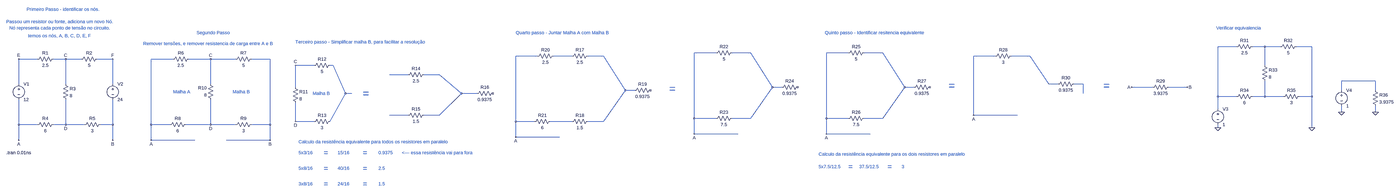
[diagram p0: schematic Mesh.asc, whole sheet]
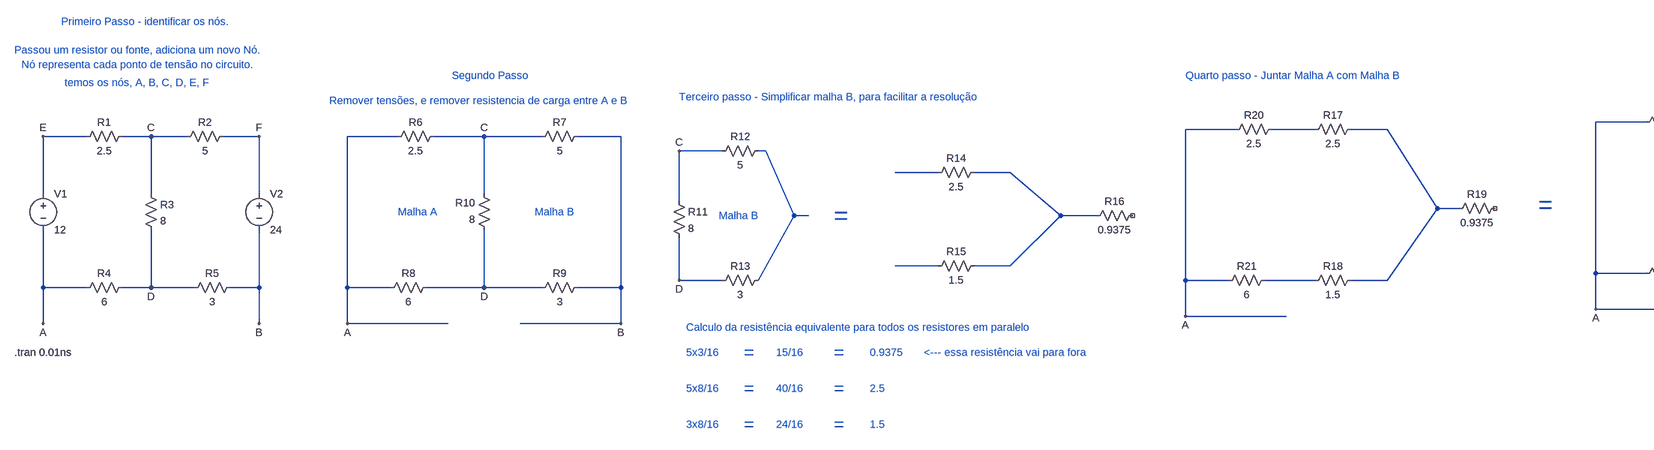
[diagram p1: schematic Mesh.asc, part, row 1 of 1, column 1 of 2]
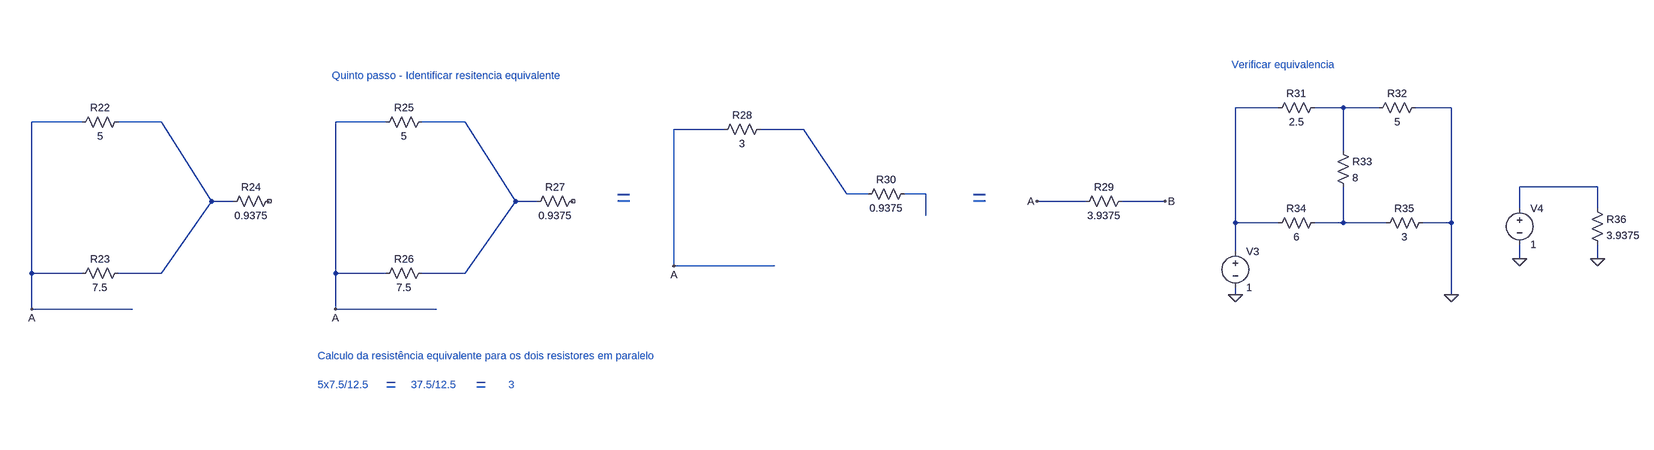
[diagram p2: schematic Mesh.asc, part, row 1 of 1, column 2 of 2]
Mesh.asc, the LTspice schematic file:
Version 4
SHEET 1 7752 680
WIRE 6704 -896 6608 -896
WIRE 6848 -896 6784 -896
WIRE 6928 -896 6848 -896
WIRE 7088 -896 7008 -896
WIRE 3168 -864 3056 -864
WIRE 3344 -864 3248 -864
WIRE 4160 -864 4048 -864
WIRE 4336 -864 4240 -864
WIRE 2256 -848 2144 -848
WIRE 2432 -848 2336 -848
WIRE 2592 -848 2512 -848
WIRE 4912 -848 4800 -848
WIRE 5088 -848 4992 -848
WIRE -576 -832 -672 -832
WIRE -432 -832 -496 -832
WIRE -352 -832 -432 -832
WIRE -192 -832 -272 -832
WIRE 128 -832 16 -832
WIRE 320 -832 208 -832
WIRE 448 -832 320 -832
WIRE 624 -832 528 -832
WIRE 976 -800 880 -800
WIRE 1072 -800 1056 -800
WIRE 6848 -800 6848 -896
WIRE 1456 -752 1360 -752
WIRE 1616 -752 1536 -752
WIRE 7648 -720 7440 -720
WIRE -672 -704 -672 -832
WIRE -432 -704 -432 -832
WIRE -192 -704 -192 -832
WIRE 320 -704 320 -832
WIRE 5184 -704 5088 -848
WIRE 5232 -704 5184 -704
WIRE 5360 -704 5312 -704
WIRE 880 -688 880 -800
WIRE 3456 -688 3344 -864
WIRE 3504 -688 3456 -688
WIRE 4448 -688 4336 -864
WIRE 4496 -688 4448 -688
WIRE 5776 -688 5664 -688
WIRE 5952 -688 5856 -688
WIRE 2704 -672 2592 -848
WIRE 2752 -672 2704 -672
WIRE 7440 -672 7440 -720
WIRE 7648 -672 7648 -720
WIRE 1136 -656 1072 -800
WIRE 1168 -656 1136 -656
WIRE 1728 -656 1616 -752
WIRE 1808 -656 1728 -656
WIRE 5360 -656 5360 -704
WIRE 6608 -640 6608 -896
WIRE 6704 -640 6608 -640
WIRE 6848 -640 6848 -720
WIRE 6848 -640 6784 -640
WIRE 6944 -640 6848 -640
WIRE 7088 -640 7088 -896
WIRE 7088 -640 7024 -640
WIRE 6608 -576 6608 -640
WIRE 7440 -560 7440 -592
WIRE 7648 -560 7648 -592
WIRE 1456 -544 1360 -544
WIRE 1616 -544 1728 -656
WIRE 1616 -544 1536 -544
WIRE 4800 -544 4800 -848
WIRE 5024 -544 4800 -544
WIRE 3056 -528 3056 -864
WIRE 3168 -528 3056 -528
WIRE 3344 -528 3456 -688
WIRE 3344 -528 3248 -528
WIRE 4048 -528 4048 -864
WIRE 4160 -528 4048 -528
WIRE 4336 -528 4448 -688
WIRE 4336 -528 4240 -528
WIRE 880 -512 880 -608
WIRE 976 -512 880 -512
WIRE 1056 -512 1136 -656
WIRE 2144 -512 2144 -848
WIRE 2240 -512 2144 -512
WIRE 2432 -512 2320 -512
WIRE 2592 -512 2704 -672
WIRE 2592 -512 2512 -512
WIRE -672 -496 -672 -624
WIRE -576 -496 -672 -496
WIRE -432 -496 -432 -624
WIRE -432 -496 -496 -496
WIRE -336 -496 -432 -496
WIRE -192 -496 -192 -624
WIRE -192 -496 -256 -496
WIRE 16 -496 16 -832
WIRE 112 -496 16 -496
WIRE 320 -496 320 -624
WIRE 320 -496 192 -496
WIRE 448 -496 320 -496
WIRE 624 -496 624 -832
WIRE 624 -496 528 -496
WIRE 6608 -480 6608 -496
WIRE 7088 -480 7088 -640
WIRE 3056 -448 3056 -528
WIRE 3280 -448 3056 -448
WIRE 4048 -448 4048 -528
WIRE 4272 -448 4048 -448
WIRE 2144 -432 2144 -512
WIRE 2368 -432 2144 -432
WIRE -672 -416 -672 -496
WIRE -192 -416 -192 -496
WIRE 16 -416 16 -496
WIRE 240 -416 16 -416
WIRE 624 -416 624 -496
WIRE 624 -416 400 -416
FLAG -672 -832 E
FLAG -432 -832 C
FLAG -192 -832 F
FLAG -672 -416 A
FLAG -192 -416 B
FLAG -432 -496 D
FLAG 16 -416 A
FLAG 624 -416 B
FLAG 2144 -432 A
FLAG 3056 -448 A
FLAG 4048 -448 A
FLAG 4800 -544 A
FLAG 320 -832 C
FLAG 320 -496 D
FLAG 5664 -688 A
FLAG 5952 -688 B
FLAG 7088 -480 0
FLAG 7648 -560 0
FLAG 7440 -560 0
FLAG 6608 -480 0
FLAG 880 -800 C
FLAG 880 -512 D
SYMBOL voltage -672 -720 R0
WINDOW 123 0 0 Left 0
WINDOW 39 0 0 Left 0
SYMATTR InstName V1
SYMATTR Value 12
SYMBOL voltage -192 -720 R0
WINDOW 123 0 0 Left 0
WINDOW 39 0 0 Left 0
SYMATTR InstName V2
SYMATTR Value 24
SYMBOL res -480 -848 R90
WINDOW 0 0 56 VBottom 2
WINDOW 3 32 56 VTop 2
SYMATTR InstName R1
SYMATTR Value 2.5
SYMBOL res -256 -848 R90
WINDOW 0 0 56 VBottom 2
WINDOW 3 32 56 VTop 2
SYMATTR InstName R2
SYMATTR Value 5
SYMBOL res -448 -720 R0
SYMATTR InstName R3
SYMATTR Value 8
SYMBOL res -480 -512 R90
WINDOW 0 0 56 VBottom 2
WINDOW 3 32 56 VTop 2
SYMATTR InstName R4
SYMATTR Value 6
SYMBOL res -240 -512 R90
WINDOW 0 0 56 VBottom 2
WINDOW 3 32 56 VTop 2
SYMATTR InstName R5
SYMATTR Value 3
SYMBOL res 224 -848 R90
WINDOW 0 0 56 VBottom 2
WINDOW 3 32 56 VTop 2
SYMATTR InstName R6
SYMATTR Value 2.5
SYMBOL res 544 -848 R90
WINDOW 0 0 56 VBottom 2
WINDOW 3 32 56 VTop 2
SYMATTR InstName R7
SYMATTR Value 5
SYMBOL res 208 -512 R90
WINDOW 0 0 56 VBottom 2
WINDOW 3 32 56 VTop 2
SYMATTR InstName R8
SYMATTR Value 6
SYMBOL res 544 -512 R90
WINDOW 0 0 56 VBottom 2
WINDOW 3 32 56 VTop 2
SYMATTR InstName R9
SYMATTR Value 3
SYMBOL res 336 -608 R180
WINDOW 0 36 76 Left 2
WINDOW 3 36 40 Left 2
SYMATTR InstName R10
SYMATTR Value 8
SYMBOL res 864 -704 R0
SYMATTR InstName R11
SYMATTR Value 8
SYMBOL res 1072 -816 R90
WINDOW 0 0 56 VBottom 2
WINDOW 3 32 56 VTop 2
SYMATTR InstName R12
SYMATTR Value 5
SYMBOL res 1072 -528 R90
WINDOW 0 0 56 VBottom 2
WINDOW 3 32 56 VTop 2
SYMATTR InstName R13
SYMATTR Value 3
SYMBOL res 1552 -768 R90
WINDOW 0 0 56 VBottom 2
WINDOW 3 32 56 VTop 2
SYMATTR InstName R14
SYMATTR Value 2.5
SYMBOL res 1552 -560 R90
WINDOW 0 0 56 VBottom 2
WINDOW 3 32 56 VTop 2
SYMATTR InstName R15
SYMATTR Value 1.5
SYMBOL res 1904 -672 R90
WINDOW 0 0 56 VBottom 2
WINDOW 3 32 56 VTop 2
SYMATTR InstName R16
SYMATTR Value 0.9375
SYMBOL res 2528 -864 R90
WINDOW 0 0 56 VBottom 2
WINDOW 3 32 56 VTop 2
SYMATTR InstName R17
SYMATTR Value 2.5
SYMBOL res 2528 -528 R90
WINDOW 0 0 56 VBottom 2
WINDOW 3 32 56 VTop 2
SYMATTR InstName R18
SYMATTR Value 1.5
SYMBOL res 2848 -688 R90
WINDOW 0 0 56 VBottom 2
WINDOW 3 32 56 VTop 2
SYMATTR InstName R19
SYMATTR Value 0.9375
SYMBOL res 2352 -864 R90
WINDOW 0 0 56 VBottom 2
WINDOW 3 32 56 VTop 2
SYMATTR InstName R20
SYMATTR Value 2.5
SYMBOL res 2336 -528 R90
WINDOW 0 0 56 VBottom 2
WINDOW 3 32 56 VTop 2
SYMATTR InstName R21
SYMATTR Value 6
SYMBOL res 3264 -880 R90
WINDOW 0 0 56 VBottom 2
WINDOW 3 32 56 VTop 2
SYMATTR InstName R22
SYMATTR Value 5
SYMBOL res 3264 -544 R90
WINDOW 0 0 56 VBottom 2
WINDOW 3 32 56 VTop 2
SYMATTR InstName R23
SYMATTR Value 7.5
SYMBOL res 3600 -704 R90
WINDOW 0 0 56 VBottom 2
WINDOW 3 32 56 VTop 2
SYMATTR InstName R24
SYMATTR Value 0.9375
SYMBOL res 4256 -880 R90
WINDOW 0 0 56 VBottom 2
WINDOW 3 32 56 VTop 2
SYMATTR InstName R25
SYMATTR Value 5
SYMBOL res 4256 -544 R90
WINDOW 0 0 56 VBottom 2
WINDOW 3 32 56 VTop 2
SYMATTR InstName R26
SYMATTR Value 7.5
SYMBOL res 4592 -704 R90
WINDOW 0 0 56 VBottom 2
WINDOW 3 32 56 VTop 2
SYMATTR InstName R27
SYMATTR Value 0.9375
SYMBOL res 5008 -864 R90
WINDOW 0 0 56 VBottom 2
WINDOW 3 32 56 VTop 2
SYMATTR InstName R28
SYMATTR Value 3
SYMBOL res 5328 -720 R90
WINDOW 0 0 56 VBottom 2
WINDOW 3 32 56 VTop 2
SYMATTR InstName R30
SYMATTR Value 0.9375
SYMBOL res 5872 -704 R90
WINDOW 0 0 56 VBottom 2
WINDOW 3 32 56 VTop 2
SYMATTR InstName R29
SYMATTR Value 3.9375
SYMBOL res 6800 -912 R90
WINDOW 0 0 56 VBottom 2
WINDOW 3 32 56 VTop 2
SYMATTR InstName R31
SYMATTR Value 2.5
SYMBOL res 7024 -912 R90
WINDOW 0 0 56 VBottom 2
WINDOW 3 32 56 VTop 2
SYMATTR InstName R32
SYMATTR Value 5
SYMBOL res 6832 -816 R0
SYMATTR InstName R33
SYMATTR Value 8
SYMBOL res 6800 -656 R90
WINDOW 0 0 56 VBottom 2
WINDOW 3 32 56 VTop 2
SYMATTR InstName R34
SYMATTR Value 6
SYMBOL res 7040 -656 R90
WINDOW 0 0 56 VBottom 2
WINDOW 3 32 56 VTop 2
SYMATTR InstName R35
SYMATTR Value 3
SYMBOL res 7632 -688 R0
SYMATTR InstName R36
SYMATTR Value 3.9375
SYMBOL voltage 7440 -688 R0
SYMATTR InstName V4
SYMATTR Value 1
SYMBOL voltage 6608 -592 R0
SYMATTR InstName V3
SYMATTR Value 1
TEXT -24 -912 Left 2 ;Remover tensões, e remover resistencia de carga entre A e B
TEXT 432 -664 Left 2 ;Malha B
TEXT 128 -664 Left 2 ;Malha A
TEXT 968 -656 Left 2 ;Malha B
TEXT 880 -920 Left 2 ;Terceiro passo - Simplificar malha B, para facilitar a resolução
TEXT 1224 -656 Left 5 ;=
TEXT -736 -1024 Left 2 ;Passou um resistor ou fonte, adiciona um novo Nó.
TEXT -720 -992 Left 2 ;Nó representa cada ponto de tensão no circuito.
TEXT -624 -952 Left 2 ;temos os nós, A, B, C, D, E, F
TEXT -632 -1088 Left 2 ;Primeiro Passo - identificar os nós.
TEXT 248 -968 Left 2 ;Segundo Passo
TEXT 2144 -968 Left 2 ;Quarto passo - Juntar Malha A com Malha B
TEXT 2928 -680 Left 5 ;=
TEXT 4040 -968 Left 2 ;Quinto passo - Identificar resitencia equivalente
TEXT 4672 -696 Left 5 ;=
TEXT 5520 -696 Left 5 ;=
TEXT 6600 -992 Left 2 ;Verificar equivalencia
TEXT -736 -352 Left 2 !.tran 0.01ns
TEXT 896 -352 Left 2 ;5x3/16
TEXT 896 -272 Left 2 ;5x8/16
TEXT 896 -192 Left 2 ;3x8/16
TEXT 1096 -352 Left 2 ;15/16
TEXT 1096 -272 Left 2 ;40/16
TEXT 1096 -192 Left 2 ;24/16
TEXT 1024 -352 Left 4 ;=
TEXT 1024 -272 Left 4 ;=
TEXT 1024 -192 Left 4 ;=
TEXT 1224 -352 Left 4 ;=
TEXT 1224 -272 Left 4 ;=
TEXT 1224 -192 Left 4 ;=
TEXT 1304 -352 Left 2 ;0.9375
TEXT 1304 -272 Left 2 ;2.5
TEXT 1304 -192 Left 2 ;1.5
TEXT 1424 -352 Left 2 ;<--- essa resistência vai para fora
TEXT 896 -408 Left 2 ;Calculo da resistência equivalente para todos os resistores em paralelo
TEXT 4008 -280 Left 2 ;5x7.5/12.5
TEXT 4216 -280 Left 2 ;37.5/12.5
TEXT 4160 -280 Left 4 ;=
TEXT 4360 -280 Left 4 ;=
TEXT 4432 -280 Left 2 ;3
TEXT 4008 -344 Left 2 ;Calculo da resistência equivalente para os dois resistores em paralelo

The netlist it stands for:
* Mesh.asc
V1 E A 12
V2 F B 24
R1 C E 2.5
R2 F C 5
R3 C D 8
R4 D A 6
R5 B D 3
R6 C A 2.5
R7 B C 5
R8 D A 6
R9 B D 3
R10 D C 8
R11 C D 8
R12 N008 C 5
R13 N008 D 3
R14 N010 N009 2.5
R15 N010 N014 1.5
R16 NC_01 N010 0.9375
R17 N006 N005 2.5
R18 N006 N015 1.5
R19 NC_02 N006 0.9375
R20 N005 A 2.5
R21 N015 A 6
R22 N003 A 5
R23 N003 A 7.5
R24 NC_03 N003 0.9375
R25 N004 A 5
R26 N004 A 7.5
R27 NC_04 N004 0.9375
R28 N007 A 3
R30 N012 N007 0.9375
R29 B A 3.9375
R31 N002 N001 2.5
R32 0 N002 5
R33 N002 N013 8
R34 N013 N001 6
R35 0 N013 3
R36 N011 0 3.9375
V4 N011 0 1
V3 N001 0 1
* Remover tensões, e remover resistencia de carga entre A e B
* Malha B
* Malha A
* Malha B
* Terceiro passo - Simplificar malha B, para facilitar a resolução
* =
* Passou um resistor ou fonte, adiciona um novo Nó.
* Nó representa cada ponto de tensão no circuito.
* temos os nós, A, B, C, D, E, F
* Primeiro Passo - identificar os nós.
* Segundo Passo
* Quarto passo - Juntar Malha A com Malha B
* =
* Quinto passo - Identificar resitencia equivalente
* =
* =
* Verificar equivalencia
.tran 0.01ns
* 5x3/16
* 5x8/16
* 3x8/16
* 15/16
* 40/16
* 24/16
* =
* =
* =
* =
* =
* =
* 0.9375
* 2.5
* 1.5
* <--- essa resistência vai para fora
* Calculo da resistência equivalente para todos os resistores em paralelo
* 5x7.5/12.5
* 37.5/12.5
* =
* =
* 3
* Calculo da resistência equivalente para os dois resistores em paralelo
.backanno
.end